# Altium project hand_logic.PrjPcb (part 1 of 3)
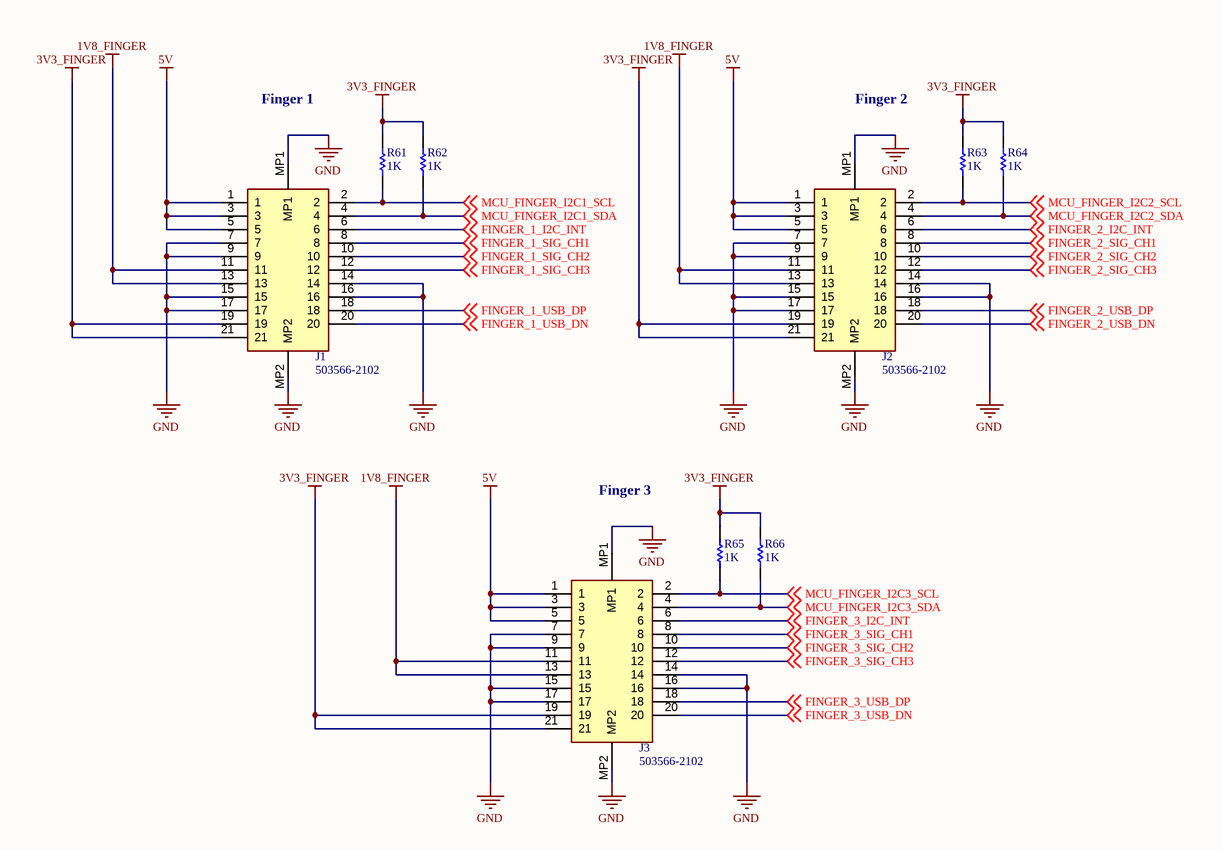
[diagram p0: FINGER_CONNECTORS.SchDoc]
15 sheets, 256 parts. Net scope: global (net labels, ports and power ports of the same name join across sheets).
Board file: hand_logic.PcbDoc
Sheets:
  FINGER_CONNECTORS.SchDoc
  PALM_CONNECTOR.SchDoc
  THUMB_CONNECTOR.SchDoc
  ISP_CONNECTORS.SchDoc
  ALLEGRO_CONNECTOR.SchDoc
  WALL_POWER.SchDoc
  HAND_CAN_MCU.SchDoc
  FINGER_MCU.SchDoc
  USB_CONNECTOR.SchDoc
  USB_HUB.SchDoc
  USB_HUB_SUPPORT.SchDoc
  USB_POWER.SchDoc
  USD_PD.SchDoc
  USB_PD_POWER.SchDoc
  FINGER_USB_HUB.SchDoc

## Sheet FINGER_CONNECTORS.SchDoc
size Letter; SheetNumber: 1; SheetTotal: 15

### Parts
J1  503566-2102  [5035662102]
J2  503566-2102  [5035662102]
J3  503566-2102  [5035662102]
R61  1K  [RESC1005X40X25LL05T10]
R62  1K  [RESC1005X40X25LL05T10]
R63  1K  [RESC1005X40X25LL05T10]
R64  1K  [RESC1005X40X25LL05T10]
R65  1K  [RESC1005X40X25LL05T10]
R66  1K  [RESC1005X40X25LL05T10]

### Nets
1V8_FINGER: J1.11 J1.13 J2.11 J2.13 J3.11 J3.13
3V3_FINGER: J1.19 J1.21 J2.19 J2.21 J3.19 J3.21 R61.2 R62.2 R63.2 R64.2 R65.2 R66.2
5V: J1.1 J1.3 J1.5 J2.1 J2.3 J2.5 J3.1 J3.3 J3.5
GND: J1.7 J1.9 J1.14 J1.15 J1.16 J1.17 J1.MP1 J1.MP2 J2.7 J2.9 J2.14 J2.15 J2.16 J2.17 J2.MP1 J2.MP2 J3.7 J3.9 J3.14 J3.15 J3.16 J3.17 J3.MP1 J3.MP2
FINGER_1_I2C_INT: J1.6 ; off-sheet FINGER_1_I2C_INT
FINGER_1_SIG_CH1: J1.8 ; off-sheet FINGER_1_SIG_CH1
FINGER_1_SIG_CH2: J1.10 ; off-sheet FINGER_1_SIG_CH2
FINGER_1_SIG_CH3: J1.12 ; off-sheet FINGER_1_SIG_CH3
FINGER_1_USB_DN: J1.20 ; off-sheet FINGER_1_USB_DN
FINGER_1_USB_DP: J1.18 ; off-sheet FINGER_1_USB_DP
FINGER_2_I2C_INT: J2.6 ; off-sheet FINGER_2_I2C_INT
FINGER_2_SIG_CH1: J2.8 ; off-sheet FINGER_2_SIG_CH1
FINGER_2_SIG_CH2: J2.10 ; off-sheet FINGER_2_SIG_CH2
FINGER_2_SIG_CH3: J2.12 ; off-sheet FINGER_2_SIG_CH3
FINGER_2_USB_DN: J2.20 ; off-sheet FINGER_2_USB_DN
FINGER_2_USB_DP: J2.18 ; off-sheet FINGER_2_USB_DP
FINGER_3_I2C_INT: J3.6 ; off-sheet FINGER_3_I2C_INT
FINGER_3_SIG_CH1: J3.8 ; off-sheet FINGER_3_SIG_CH1
FINGER_3_SIG_CH2: J3.10 ; off-sheet FINGER_3_SIG_CH2
FINGER_3_SIG_CH3: J3.12 ; off-sheet FINGER_3_SIG_CH3
FINGER_3_USB_DN: J3.20 ; off-sheet FINGER_3_USB_DN
FINGER_3_USB_DP: J3.18 ; off-sheet FINGER_3_USB_DP
MCU_FINGER_I2C1_SCL: J1.2 R61.1 ; off-sheet MCU_FINGER_I2C1_SCL
MCU_FINGER_I2C1_SDA: J1.4 R62.1 ; off-sheet MCU_FINGER_I2C1_SDA
MCU_FINGER_I2C2_SCL: J2.2 R63.1 ; off-sheet MCU_FINGER_I2C2_SCL
MCU_FINGER_I2C2_SDA: J2.4 R64.1 ; off-sheet MCU_FINGER_I2C2_SDA
MCU_FINGER_I2C3_SCL: J3.2 R65.1 ; off-sheet MCU_FINGER_I2C3_SCL
MCU_FINGER_I2C3_SDA: J3.4 R66.1 ; off-sheet MCU_FINGER_I2C3_SDA

### Notes on the sheet
- Finger 1
- Finger 2
- Finger 3
- Title
- Copyright (c) Meta Platforms, Inc. and affiliates.
  All rights reserved.
  This source code is licensed under the license found in the
  LICENSE file in the root directory of this source tree.
- Sheet
- of

### Library data of the parts
J1-J3 = 503566-2102: Connector; Manufacturer_Name: Molex; Datasheet Link: https://www.molex.com/pdm_docs/sd/5035662102_sd.pdf; Height: 1.69mm; Manufacturer_Part_Number: 503566-2102; Mouser Part Number: 538-503566-2102; Mouser Price/Stock: https://www.mouser.co.uk/ProductDetail/Molex/503566-2102?qs=0lSvoLzn4L8%252Bw2FHrppS3g%3D%3D
R61-R66 = CMP-2002-07941-1: Part Number: RC0402JR-071KL; Manufacturer: Yageo / Phycomp

## Sheet PALM_CONNECTOR.SchDoc
size Letter; SheetNumber: 2; SheetTotal: 15
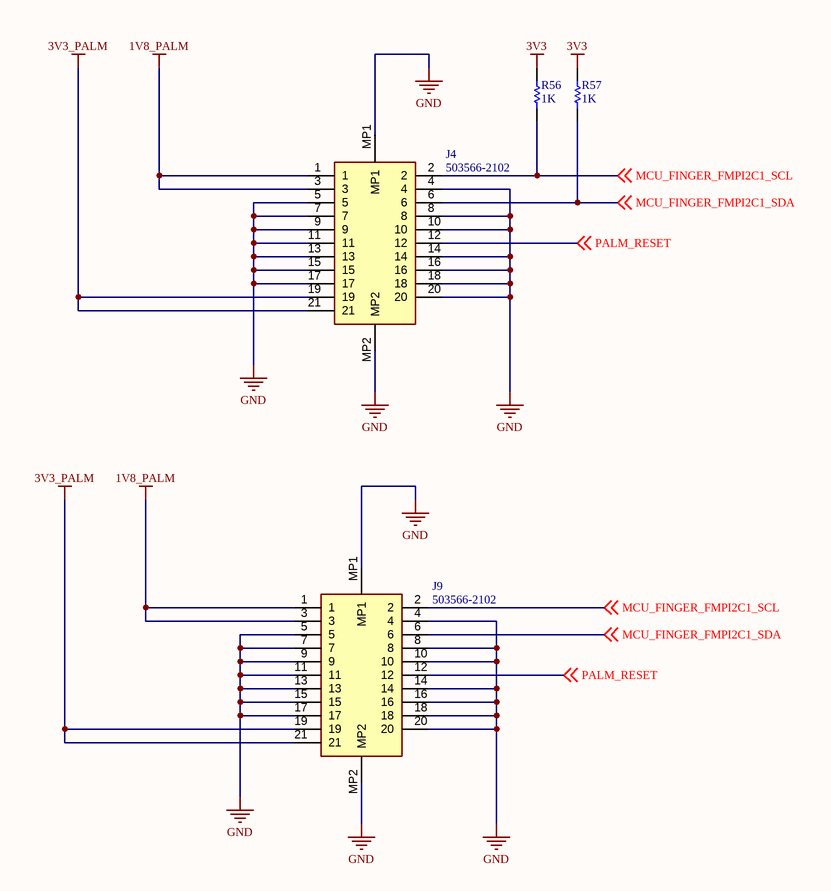
[diagram p1: PALM_CONNECTOR.SchDoc]

### Parts
J4  503566-2102  [5035662102]
J9  503566-2102  [5035662102]
R56  1K  [RESC1005X40X25LL05T10]
R57  1K  [RESC1005X40X25LL05T10]

### Nets
1V8_PALM: J4.1 J4.3 J9.1 J9.3
3V3: R56.2 R57.2
3V3_PALM: J4.19 J4.21 J9.19 J9.21
GND: J4.4 J4.5 J4.7 J4.8 J4.9 J4.10 J4.11 J4.13 J4.14 J4.15 J4.16 J4.17 J4.18 J4.20 J4.MP1 J4.MP2 J9.4 J9.5 J9.7 J9.8 J9.9 J9.10 J9.11 J9.13 J9.14 J9.15 J9.16 J9.17 J9.18 J9.20 J9.MP1 J9.MP2
MCU_FINGER_FMPI2C1_SCL: J4.2 J9.2 R56.1 ; off-sheet MCU_FINGER_FMPI2C1_SCL
MCU_FINGER_FMPI2C1_SDA: J4.6 J9.6 R57.1 ; off-sheet MCU_FINGER_FMPI2C1_SDA
PALM_RESET: J4.12 J9.12 ; off-sheet PALM_RESET

### Notes on the sheet
- Title
- Copyright (c) Meta Platforms, Inc. and affiliates.
  All rights reserved.
  This source code is licensed under the license found in the
  LICENSE file in the root directory of this source tree.
- Sheet
- of

### Library data of the parts
J4 J9 = 503566-2102: Connector; Manufacturer_Name: Molex; Datasheet Link: https://www.molex.com/pdm_docs/sd/5035662102_sd.pdf; Height: 1.69mm; Manufacturer_Part_Number: 503566-2102; Mouser Part Number: 538-503566-2102; Mouser Price/Stock: https://www.mouser.co.uk/ProductDetail/Molex/503566-2102?qs=0lSvoLzn4L8%252Bw2FHrppS3g%3D%3D
R56 R57 = CMP-2002-07941-1: as R61 on sheet FINGER_CONNECTORS

## Sheet THUMB_CONNECTOR.SchDoc
size Letter; SheetNumber: 3; SheetTotal: 15
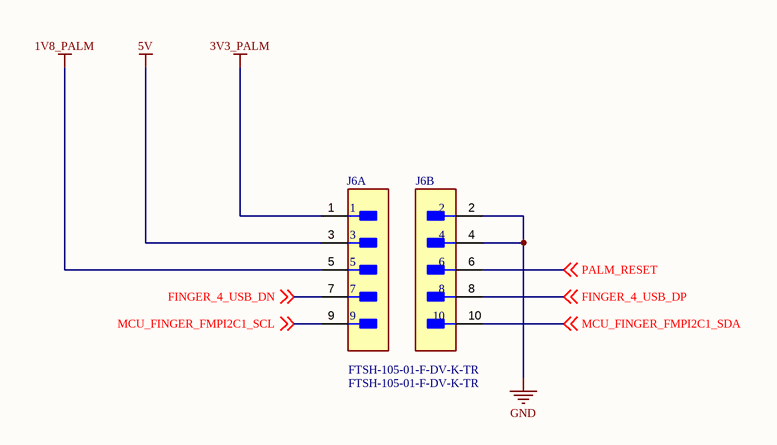
[diagram p2: THUMB_CONNECTOR.SchDoc]

### Parts
J6  FTSH-105-01-F-DV-K-TR  [FP-FTSH-105-01-F-DV-K-TR-MFG]  (parts A,B of 2)

### Nets
1V8_PALM: J6.5
3V3_PALM: J6.1
5V: J6.3
GND: J6.2 J6.4
FINGER_4_USB_DN: J6.7 ; off-sheet FINGER_4_USB_DN
FINGER_4_USB_DP: J6.8 ; off-sheet FINGER_4_USB_DP
MCU_FINGER_FMPI2C1_SCL: J6.9 ; off-sheet MCU_FINGER_FMPI2C1_SCL
MCU_FINGER_FMPI2C1_SDA: J6.10 ; off-sheet MCU_FINGER_FMPI2C1_SDA
PALM_RESET: J6.6 ; off-sheet PALM_RESET

### Notes on the sheet
- Title
- Copyright (c) Meta Platforms, Inc. and affiliates.
  All rights reserved.
  This source code is licensed under the license found in the
  LICENSE file in the root directory of this source tree.
- Sheet
- of

### Library data of the parts
J6 = CMP-02766-000004-2: CONN HEADER SMD 10POS 1.27MM; Number of Contacts: 10; Max Current Rating: 1.75A; Max Operating Temperature: 125°C; Number of Rows: 2; Pitch: 1.27mm; Contact Plating: Gold; Length: 6.35mm; Min Operating Temperature: -55°C; Packaging: Tape and Reel; Orientation: Straight; Contact Material: Bronze; Depth: 3.43mm; Housing Color: Black; Housing Material: Polymer; Radiation Hardening: No; Termination: Solder; Lead Free: Lead Free

## Sheet ISP_CONNECTORS.SchDoc
size Letter; SheetNumber: 4; SheetTotal: 15
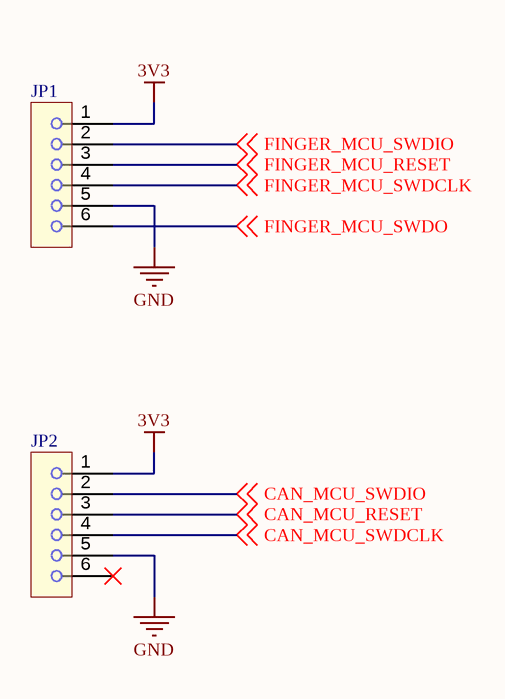
[diagram p3: ISP_CONNECTORS.SchDoc]

### Parts
JP1  TC2030-6-NL-FOOTPRINT  [TAG_TC2030_NL_6]  (value not drawn)  (no BOM)
JP2  TC2030-6-NL-FOOTPRINT  [TAG_TC2030_NL_6]  (value not drawn)  (no BOM)

### Nets
3V3: JP1.1 JP2.1
GND: JP1.5 JP2.5
CAN_MCU_RESET: JP2.3 ; off-sheet CAN_MCU_RESET
CAN_MCU_SWDCLK: JP2.4 ; off-sheet CAN_MCU_SWDCLK
CAN_MCU_SWDIO: JP2.2 ; off-sheet CAN_MCU_SWDIO
FINGER_MCU_RESET: JP1.3 ; off-sheet FINGER_MCU_RESET
FINGER_MCU_SWDCLK: JP1.4 ; off-sheet FINGER_MCU_SWDCLK
FINGER_MCU_SWDIO: JP1.2 ; off-sheet FINGER_MCU_SWDIO
FINGER_MCU_SWDO: JP1.6 ; off-sheet FINGER_MCU_SWDO

Not connected (* = marked no-connect by the designer): JP2 6*

### Notes on the sheet
- Title
- Copyright (c) Meta Platforms, Inc. and affiliates.
  All rights reserved.
  This source code is licensed under the license found in the
  LICENSE file in the root directory of this source tree.
- Sheet
- of

### Library data of the parts
JP1 JP2 = TC2030-6-NL-FOOTPRINT: CONN, FP, 2X3, .05, DEBUG, SMT; Manufacturer: NO PART; Part Number: FOOTPRINT ONLY

## Sheet ALLEGRO_CONNECTOR.SchDoc
size Letter; SheetNumber: 5; SheetTotal: 15; SPICEModelCacheFIYDHHWJ: <root> / <DocumentId>FIYDHHWJ</DocumentId> / <CacheFrame Number="0"> / <Model Name="umk325b7475_n-tr" Kind="CKT"> / <Text>* UMK325B7475_N-TR     SPICE MODEL  ( General Type ) / *-------------------------------------------------------------------------------------------------------- / * Model Generated by TAIYO YUDEN Corporation (http://www.ty-top.com) / * Version 1.0 / * TAIYO YUDEN Control No. 170508_110722 / * Copyright(c) 2012 TAIYO YUDEN CO.,LTD. All Rights Reserved. / *-------------------------------------------------------------------------------------------------------- / * / * Products Name : Multilayer Ceramic Capacitors / * / * Characteristics : / *     Capacitance : 4.7 uF , Rated Voltage : 50V , TCC : X7R / *     Case Size : 3.2 x 2.5 / 0.126 x 0.098 [mm/inch] , Thickness : 1.9 / 0.075 [mm/inch] / *     (Conditions: Temperature = 25 degC , DC Bias Current/Voltage = 0A / 0V) / * / * Frequency Range : 40Hz - 3GHz / * / * External Node Assignments : / * / *  1  o---| |---o  2 / * / *-------------------------------------------------------------------------------------------------------- / .SubCkt UMK325B7475_N-TR 1 2 / **************************** / C0 1 110 4.2842u / Cm 1 101 0.26769u / Rc1 101 102 1.3219 / C2 102 103 0.15728u / Rc2 102 103 266.31 / C3 103 110 22.789p / Rc3 103 110 35.595 / C2m 1 301 0.28635u / Rc21 301 302 14.59 / C22 302 303 1.5087u / Rc22 302 303 1.0546k / C23 303 304 0.049481u / Rc23 303 304 2.7033k / C24 304 305 0.062261u / Rc24 304 305 2.0733k / C25 305 110 58.302p / Rc25 305 110 991.63 / Rp0 1 110 106.382978723404Meg / L0 110 120 0.2425n / Lm 120 130 0.37058n / L1 120 121 0.44043n / RL1 121 130 0.21947 / L2 120 122 1.079n / RL2 122 130 0.54298 / L3 120 123 1.1393n / RL3 123 130 0.57182 / CR 120 124 0.72832u / LR 124 125 0.42802n / RR 125 130 36.415m / CL 130 140 14.134p / LL 130 140 0.20042n / RL 130 140 6.3872 / Rs 140 2 5.0797m / **************************** / .ends UMK325B7475_N-TR</Text> / </Model> / </CacheFrame> / </root>
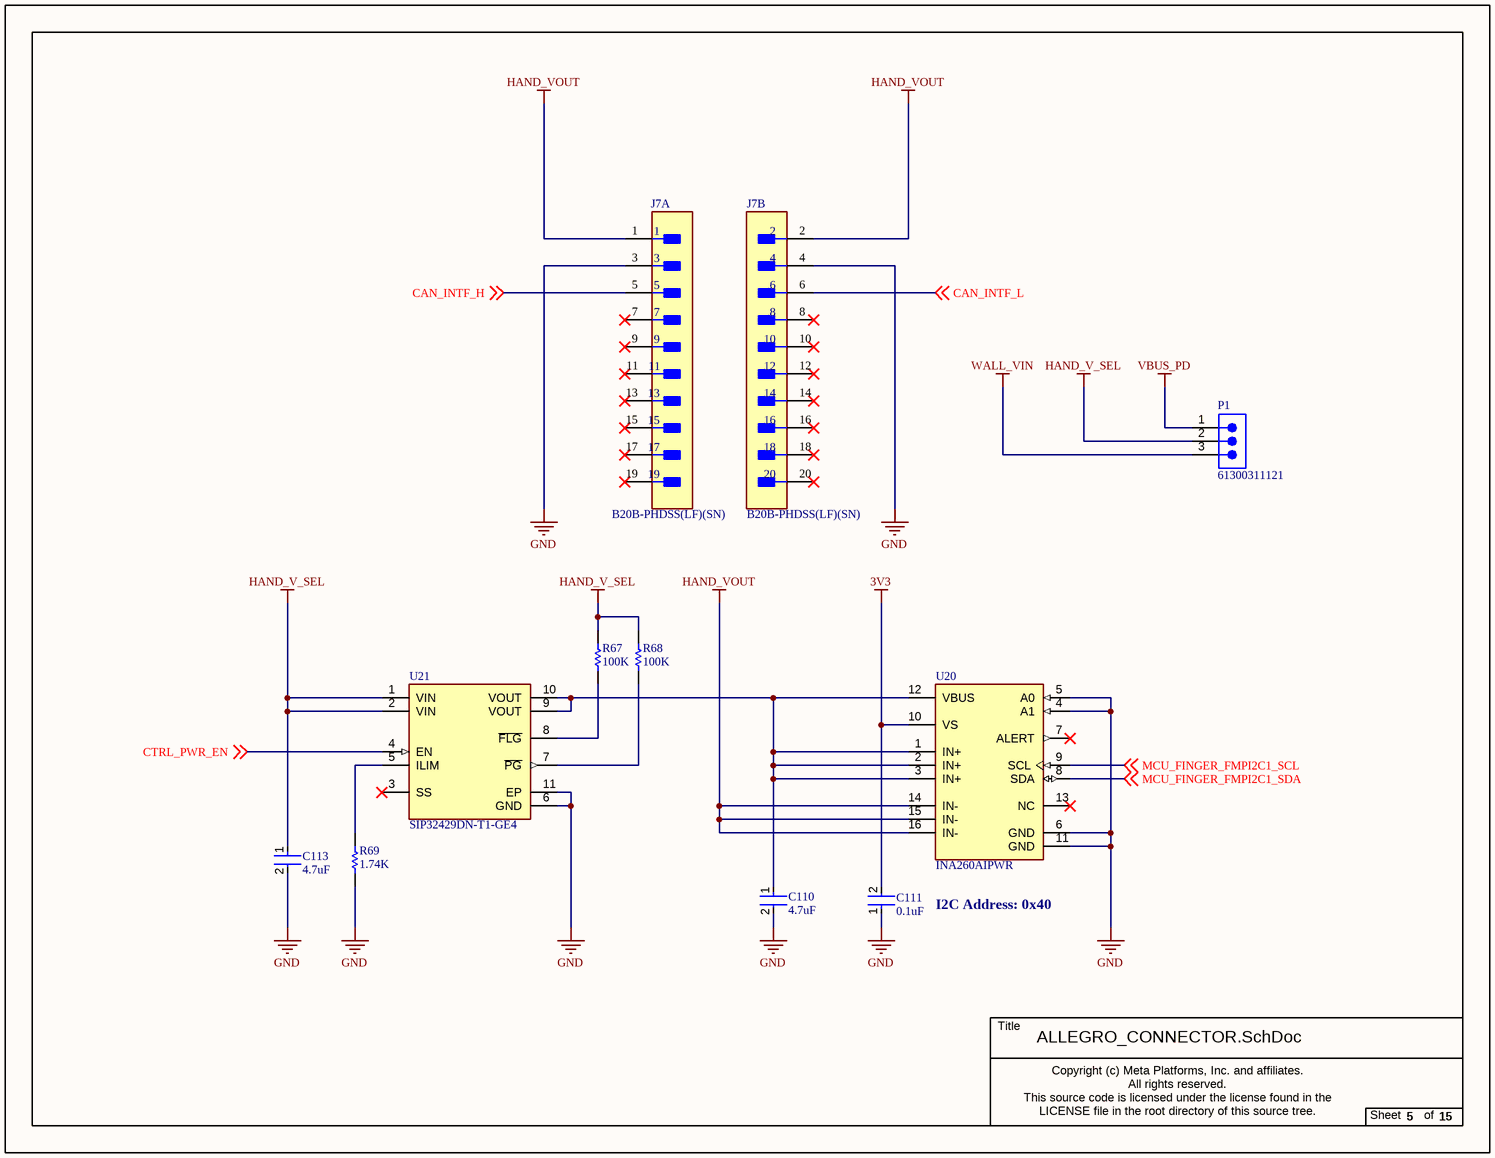
[diagram p4: ALLEGRO_CONNECTOR.SchDoc]

### Parts
C110  4.7uF  [FP-1210-L_3_2_0_3-W_2_5_0-IPC_B]
C111  0.1uF  [FP-CC0201-BA-MFG]
C113  4.7uF  [FP-1210-L_3_2_0_3-W_2_5_0-IPC_B]
J7  B20B-PHDSS(LF)(SN)  [FP-B20B-PHDSS_LF_SN-MFG]  (parts A,B of 2)
P1  61300311121  [61300311121]
R67  100K  [RESC1005X40X25NL05T10]
R68  100K  [RESC1005X40X25NL05T10]
R69  1.74K  [RESC1005X35X20ML05T10]
U20  INA260AIPWR  [FP-PW0016A-MFG]
U21  SIP32429DN-T1-GE4  [FP-S-42134-IPC_C]

### Nets
3V3: C111.2 U20.10(VS)
GND: C110.2 C111.1 C113.2 J7.3 J7.4 R69.1 U20.4(A1) U20.5(A0) U20.6(GND) U20.11(GND) U21.6(GND) U21.11(EP)
HAND_V_SEL: C113.1 P1.2 R67.2 R68.2 U21.1(VIN) U21.2(VIN)
HAND_VOUT: J7.1 J7.2 U20.14(IN-) U20.15(IN-) U20.16(IN-)
VBUS_PD: P1.1
WALL_VIN: P1.3
CAN_INTF_H: J7.5 ; off-sheet CAN_INTF_H
CAN_INTF_L: J7.6 ; off-sheet CAN_INTF_L
CTRL_PWR_EN: U21.4(EN) ; off-sheet CTRL_PWR_EN
MCU_FINGER_FMPI2C1_SCL: U20.9(SCL) ; off-sheet MCU_FINGER_FMPI2C1_SCL
MCU_FINGER_FMPI2C1_SDA: U20.8(SDA) ; off-sheet MCU_FINGER_FMPI2C1_SDA
NetC110_1: C110.1 U20.1(IN+) U20.2(IN+) U20.3(IN+) U20.12(VBUS) U21.9(VOUT) U21.10(VOUT)
NetR67_1: R67.1 U21.8(~{FLG})
NetR68_1: R68.1 U21.7(~{PG})
NetR69_2: R69.2 U21.5(ILIM)

Not connected (* = marked no-connect by the designer): J7 7* 8* 9* 10* 11* 12* 13* 14* 15* 16* 17* 18* 19* 20*; U20 7(ALERT)* 13(NC)*; U21 3(SS)*

### Notes on the sheet
- I2C Address: 0x40
- Title
- Copyright (c) Meta Platforms, Inc. and affiliates.
  All rights reserved.
  This source code is licensed under the license found in the
  LICENSE file in the root directory of this source tree.
- Sheet
- of

### Library data of the parts
C110 C113 = CMP-14477-001522-2: None; RoHS Compliant: Yes
C111 = CMP-03422-000376-1: CAP CER 0.1UF 6.3V X5R 0201; Manufacturer: Yageo; Manufacturer Part Number: CC0201KRX5R5BB104; Tolerance: 0.1; Temperature Coefficient: 15%; Value: 100 nF; Material: Ceramic; Automotive: No; Device Class L2: Capacitors; Temperature Range High: +85°C; Capacitance: 100 nF; Temperature: -55°C to +85°C; ComponentLink2URL: http://www.yageo.com/documents/recent/UPY-GPHC_X5R_4V-to-50V_25.pdf; Category: Cap; Mouser Description: Multilayer Ceramic Capacitors MLCC - SMD/SMT 100nF 6.3V X5R 10%; Ipc Land Pattern Name: CAPC6030X30; Temperature Characteristic: X5R; Voltage Rating: 6.3 V; Lead Free: Yes; Digikey Description: CAP CER 0.1UF 6.3V X5R 0201; Device Class L1: Passive Components; Octopart: https://octopart.com/cc0201krx5r5bb104-yageo-9292636; Height: 0.33mm; Package: CC0201-BA; Footprint Url: http://www.yageo.com/exep/pages/download/literatures/UPY-C_GEN_24.pdf; ComponentLink2Description: Datasheet; Device Class L3: Ceramic Capacitors; Temperature Range Low: -55°C; RoHS: TRUE
J7 = CMP-17439-000286-1: CONN HEADER VERT 20POS 2MM; Contact Resistance: 20mR; Current Rating: 3A; Number of Positions: 20; Gender: Male; Row Spacing: 0.079inch; Max Voltage Rating (DC): 250V; Mated Stacking Heights: 8.8mm; Contact Mating Length: 0.13inch; Lead Free: Lead Free; Pitch: 2mm; Fastening Type: Detent; Contact Shape: Square; Contact Type: Male Pin; Series: PHD; Max Current Rating: 3A; Housing Material: Polyamide; Width: 5mm; Depth: 5mm; Housing Color: Beige; Number of Contacts: 20; Flammability Rating: UL94 V-0; Insulation Color: Natural; Number of Rows: 2; Mount: Through Hole; Termination: Solder; Height: 9.5mm; Voltage Rating: 250V; Contact Finish - Mating: TIN; Color: Natural; Contact Plating: Copper; Min Operating Temperature: -25°C; Insulation Material: Nylon; Orientation: Straight; Max Operating Temperature: 85°C; Max Voltage Rating (AC): 250V; Length: 21.9mm; Packaging: Bulk; Connector Type: Header; Contact Material: Copper Alloy
P1 = CMP-1502-01062-2: NexarPartId: 32855521; Voltage Rating: 250V; Current Rating: 3A; Connector Type: Male Pin; Number of Positions: 3; Gender: Male; Contact Resistance: 20mΩ; Pitch: 2.54mm; Max Operating Temperature: 105°C; Lead Pitch: 2.54mm; Lead Free: Lead Free; Contact Mating Length: 5.9944mm; Contact Material: Copper; Number of Pins: 3; Orientation: Vertical; Height: 8.94mm; Packaging: Bulk; Min Operating Temperature: -40°C; Mount: Through Hole; RoHS: Compliant; Number of Contacts: 3; Operating Supply Voltage: 250V; Termination: Solder; Number of Rows: 1; Contact Plating: Gold; Color: Black; REACH SVHC: Unknown
R67 R68 = CMP-2002-07343-1: Part Number: RC0402FR-07100KL; Manufacturer: Yageo / Phycomp
R69 = CMP-2002-03190-1: Manufacturer: TE Connectivity / AMP; Part Number: CPF0402B1K74E1
U20 = CMP-04910-000015-1: IC MONITOR PWR/CURR 16TSSOP; Manufacturer: Texas Instruments; Nominal Supply Current: 310uA; Max Junction Temp: +150°C; Standoff Height: 0.05mm; Max Supply Voltage: 5.5V; Min Supply Voltage: 2.7V; Output Current: 10mA; Ambient Temperature Range High: +125°C; ComponentLink2Description: Datasheet; Manufacturer Part Number: INA260AIPWR; Automotive: No; RoHS: TRUE; Lead Free: Yes; Package: PW0016A; Device Class L2: Power Management ICs; Temperature Range Low: -40°C; Digikey Description: IC MONITOR PWR/CURR 16TSSOP; Height: 1.2mm; Temperature: -40°C to +125°C; Device Class L1: Integrated Circuits (ICs); Device Class L3: unset; Octopart: https://octopart.com/ina260aipwr-texas+instruments-75199489; Category: IC; Ambient Temperature Range Low: -40°C; Temperature Range High: +125°C; ComponentLink2URL: http://www.ti.com/lit/ds/symlink/ina260.pdf
U21 = CMP-02501-000003-1: IC PWR SWITCH P-CHAN 1:1 10DFN; Turn-Off Delay Time: 1us; Output Configuration: High Side; Number of Outputs: 1; Fault Protection: Over Temperature; Max Supply Voltage: 28V; On-State Resistance: 56mR; Min Supply Voltage: 6V; Max Output Current: 3.5A; Turn-On Delay Time: 550us; Max Power Dissipation: 1.42W; Interface: On/Off; Max Operating Temperature: 85°C; Radiation Hardening: No; Min Operating Temperature: -40°C; Number of Pins: 10; Package Quantity: 2500; Case/Package: DFN; Weight: 0.001764oz; Packaging: Tape and Reel; Mount: Surface Mount

## Sheet WALL_POWER.SchDoc
size Letter; SheetNumber: 6; SheetTotal: 15; SPICEModelCacheTADBTSLA: <root> / <DocumentId>TADBTSLA</DocumentId> / </root>
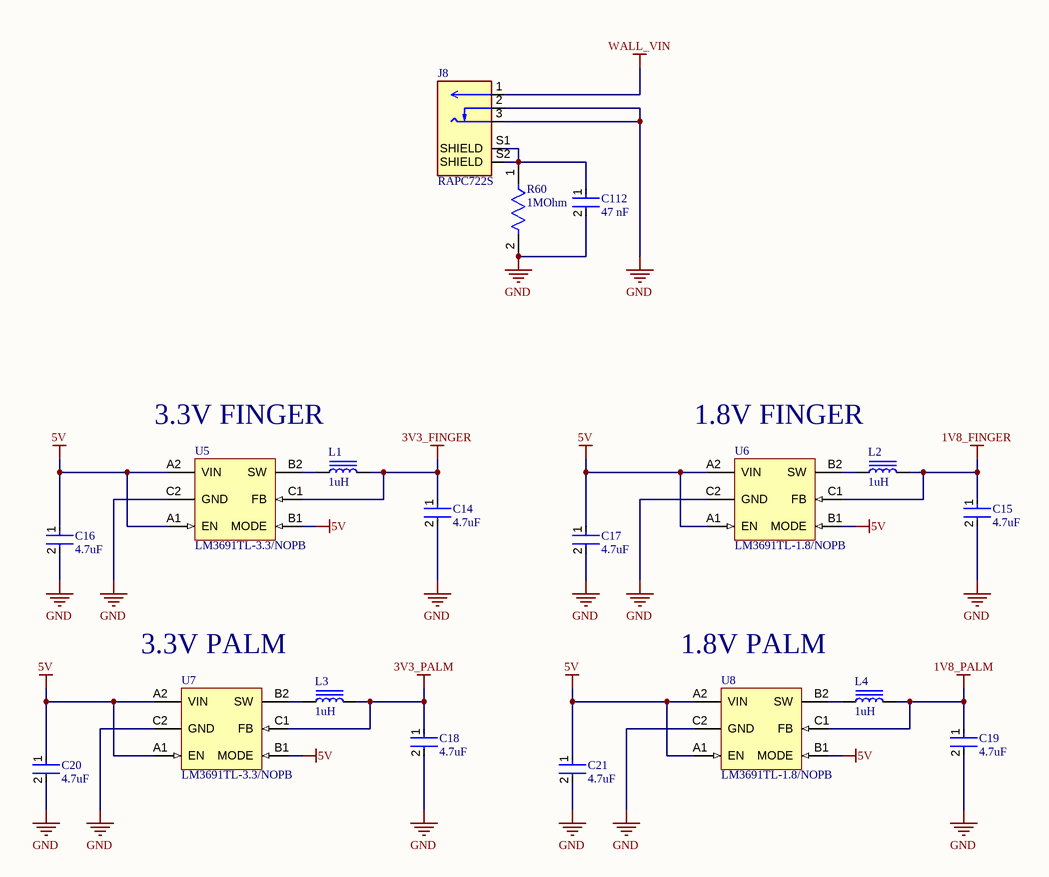
[diagram p5: WALL_POWER.SchDoc]

### Parts
C14  4.7uF  [FP-CL828-IPC_C]
C15  4.7uF  [FP-CL828-IPC_C]
C16  4.7uF  [FP-CL828-IPC_C]
C17  4.7uF  [FP-CL828-IPC_C]
C18  4.7uF  [FP-CL828-IPC_C]
C19  4.7uF  [FP-CL828-IPC_C]
C20  4.7uF  [FP-CL828-IPC_C]
C21  4.7uF  [FP-CL828-IPC_C]
C112  47 nF  [FP-CC0402-MFG]
J8  RAPC722S  [SWITCHCRAFT_RAPC722S]
L1  1uH  [IND 0603_1608 RF WW]
L2  1uH  [IND 0603_1608 RF WW]
L3  1uH  [IND 0603_1608 RF WW]
L4  1uH  [IND 0603_1608 RF WW]
R60  1MOhm  [FP-RMCF0402-MFG]
U5  LM3691TL-3.3/NOPB  [YZR0006APAF]
U6  LM3691TL-1.8/NOPB  [YZR0006APAF]
U7  LM3691TL-3.3/NOPB  [YZR0006APAF]
U8  LM3691TL-1.8/NOPB  [YZR0006APAF]

### Nets
1V8_FINGER: C15.1 L2.2 U6.C1(FB)
1V8_PALM: C19.1 L4.2 U8.C1(FB)
3V3_FINGER: C14.1 L1.2 U5.C1(FB)
3V3_PALM: C18.1 L3.2 U7.C1(FB)
5V: C16.1 C17.1 C20.1 C21.1 U5.A1(EN) U5.A2(VIN) U5.B1(MODE) U6.A1(EN) U6.A2(VIN) U6.B1(MODE) U7.A1(EN) U7.A2(VIN) U7.B1(MODE) U8.A1(EN) U8.A2(VIN) U8.B1(MODE)
GND: C14.2 C15.2 C16.2 C17.2 C18.2 C19.2 C20.2 C21.2 C112.2 J8.2(SHUNT) J8.3(TIP) R60.2 U5.C2(GND) U6.C2(GND) U7.C2(GND) U8.C2(GND)
WALL_VIN: J8.1(PIN)
NetC112_1: C112.1 J8.S1(SHIELD) J8.S2(SHIELD) R60.1
NetL1_1: L1.1 U5.B2(SW)
NetL2_1: L2.1 U6.B2(SW)
NetL3_1: L3.1 U7.B2(SW)
NetL4_1: L4.1 U8.B2(SW)

### Notes on the sheet
- 3.3V FINGER
- 1.8V FINGER
- 3.3V PALM
- 1.8V PALM
- Title
- Copyright (c) Meta Platforms, Inc. and affiliates.
  All rights reserved.
  This source code is licensed under the license found in the
  LICENSE file in the root directory of this source tree.
- Sheet
- of

### Library data of the parts
C14-C21 = CMP-13271-001251-1: Cap Ceramic 4.7uF 10V X5R ±10% SMD 0402 +85°C Paper T/R; Height: 0.5mm; Mount: Surface Mount; Case Code (Metric): 1005; Case/Package: 0402; Capacitance: 4.7uF; Packaging: Tape and Reel; Dielectric: X5R; Radiation Hardening: No; Material: Ceramic; Thickness: 0.022inch; Min Operating Temperature: -55°C; Voltage Rating: 10V; Case Code (Imperial): 0402; Width: 0.02inch; Length: 1mm; Max Operating Temperature: 85°C; Lead Free: Lead Free; Tolerance: 10%; Package Quantity: 1; Depth: 0.5mm
C112 = CMP-03422-000813-1: CAP CER 0.047UF 25V X7R 0402; Manufacturer Part Number: CC0402KRX7R8BB473; Manufacturer: YAGEO; Automotive Grade: NA; Temperature Coefficient: 30ppm/°C; Material: Ceramic; Tolerance: 0.1; Temperature: -55°C to +125°C; Category: Cap; Voltage Rating: 25 V; Digikey Description: CAP CER 0.047UF 25V X7R 0402; Device Class L1: Passive Components; Device Class L3: Ceramic Capacitors; Ipc Land Pattern Name: CAPC10050X50; Value: 47 nF; Temperature Characteristic: X7R; Temperature Range High: +125°C; ComponentLink2URL: http://www.yageo.com/documents/recent/UPY-GP_NP0_16V-to-50V_16.pdf; Automotive: No; Temperature Range Low: -55°C; Package: CC0402; RoHS: TRUE; Height: 0.55mm; Device Class L2: Capacitors; Capacitance: 47 nF; Octopart: https://octopart.com/cc0402krx7r8bb473-yageo-22850998; Lead Free: Yes; Mouser Description: Multilayer Ceramic Capacitors MLCC - SMD/SMT 47nF 25V X7R 10%; Footprint Url: http://www.yageo.com/exep/pages/download/literatures/UPY-C_GEN_24.pdf; ComponentLink2Description: Datasheet
J8 = RAPC722S: Power Barrel Connector Jack 2.10mm ID (0.083), 5.50mm OD (0.217) Through Hole, Right Angle; MF: Switchcraft Inc.; Package: None; Digi-Key_Part_Number: SC3723-ND; Purchase-URL: https://pricing.snapeda.com/search/part/RAPC722S/?ref=eda; Value: *; SnapEDA_Link: https://www.snapeda.com/parts/RAPC722S/Switchcraft+%252F+Conxall/view-part/?ref=snap; Check_prices: https://www.snapeda.com/parts/RAPC722S/Switchcraft+%252F+Conxall/view-part/?ref=eda; MP: RAPC722S
L1-L4 = MCHK1608T1R0MKN: SMT Inductor; Manufacturer: Taiyo Yuden; Part Number: MCHK1608T1R0MKN; Value: 1uH
R60 = CMP-2000-06985-2: 1MΩ ±1% 0.063W 0402 Thick Film Chip Resistor AEC-Q200 compliant; Max Power Dissipation: 63mW; Resistance: 1MR; Power Rating: 62.5mW; Temperature Coefficient: 100ppm/°C; Resistor Type: Thick Film; Military Standard: Not; Packaging: Tape and Reel; Radiation Hardening: No; Construction: Rectangular; Length: 1mm; Case/Package: 0402; Width: 0.02inch; Case Code (Imperial): 0402; Lead Free: Lead Free; Number of Terminations: 2; Min Operating Temperature: -55°C; Height: 0.016inch; Tolerance: 1%; Contact Plating: Tin; Case Code (Metric): 1005; Depth: 0.5mm; Features: Automotive AEC-Q200; Max Operating Temperature: 155°C; Size Code: 0402; Mount: Surface Mount; RoHS Compliant: Yes; Series: RMCF
U5 U7 = CMP-0063-01484-2: High Accuracy, Miniature 1A, Step-Down DC-DC Converter for Portable Applications, 6-pin Micro SMD, 250 Reel; Manufacturer: Texas Instruments; PackageTopMarking: XV*I T; PowerWise: N; CompType: MiscPower; High-Reliability: Y; RoHS: Y; PackageDescription: Thin Micro SMD, 6 Bump (Large), 0.5mm Pitch; PinCount: 6; ComponentLink1URL: http://www.ti.com/general/docs/lit/getliterature.tsp?genericPartNumber=LM3691&fileType=pdf; PackageReference: YZR0006APAF; PartNumber: LM3691TL-3.3/NOPB; ComponentLink1Description: Datasheet URL; Code_JEDEC: MO-211-DB
U6 U8 = CMP-0063-00271-3: High Accuracy, Miniature 1A, Step-Down DC-DC Converter for Portable Applications, 6-pin Micro SMD, Pb-Free; Manufacturer: Texas Instruments; PackageTopMarking: XV*I Z; CompType: MiscPower; High-Reliability: Y; PinCount: 6; PartNumber: LM3691TL-1.8/NOPB; PackageDescription: Thin Micro SMD, 6 Bump (Large), 0.5mm Pitch; RoHS: Y; PackageReference: YZR0006APAF; ComponentLink1URL: http://www.ti.com/general/docs/lit/getliterature.tsp?genericPartNumber=LM3691&fileType=pdf; Code_JEDEC: MO-211-DB; ComponentLink1Description: Datasheet URL; PowerWise: Y

## Sheet HAND_CAN_MCU.SchDoc
size Letter; SheetNumber: 7; SheetTotal: 15
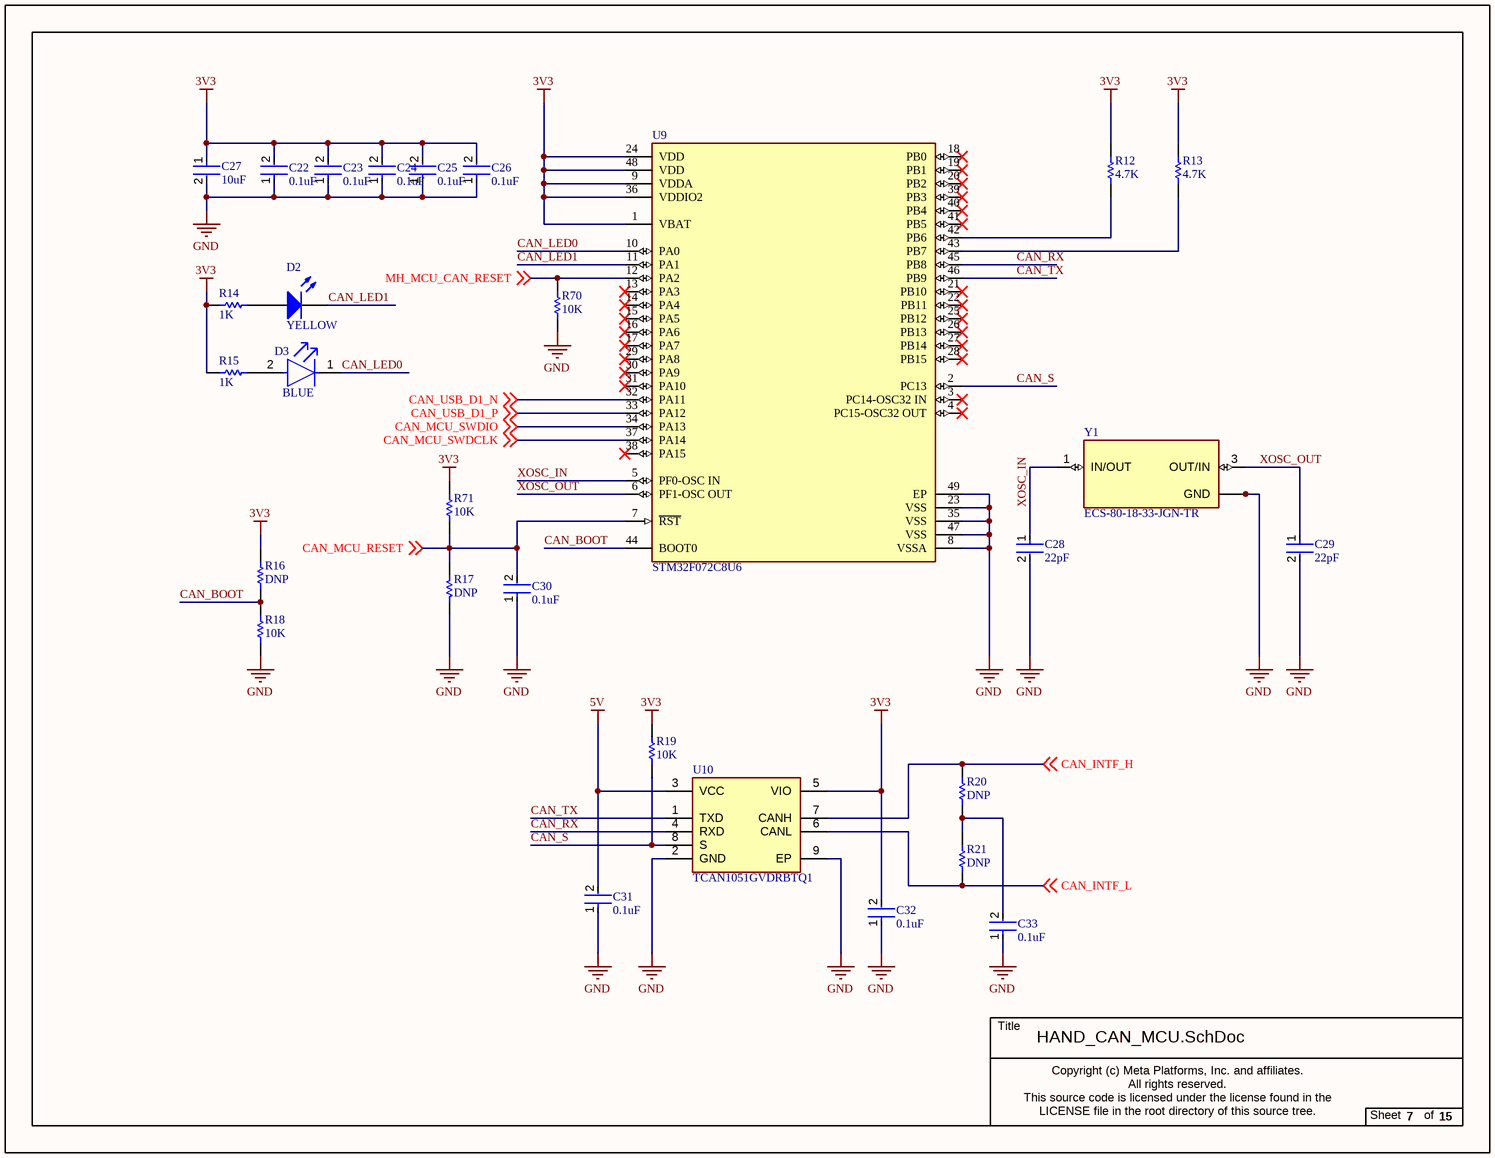
[diagram p6: HAND_CAN_MCU.SchDoc]

### Parts
C22  0.1uF  [FP-CC0201-BA-MFG]
C23  0.1uF  [FP-CC0201-BA-MFG]
C24  0.1uF  [FP-CC0201-BA-MFG]
C25  0.1uF  [FP-CC0201-BA-MFG]
C26  0.1uF  [FP-CC0201-BA-MFG]
C27  10uF  [FP-CL05A106MP5NUNC-MFG]
C28  22pF  [FP-0402-L_1_0_1-W_0_5_0_1-MFG]
C29  22pF  [FP-0402-L_1_0_1-W_0_5_0_1-MFG]
C30  0.1uF  [FP-CC0201-BA-MFG]
C31  0.1uF  [FP-CC0201-BA-MFG]
C32  0.1uF  [FP-CC0201-BA-MFG]
C33  0.1uF  [FP-CC0201-BA-MFG]
D2  YELLOW  [0603_A]
D3  BLUE  [FP-LTST-C191TBKT-MFG]
R12  4.7K  [RESC1005X40X25LL05T05]
R13  4.7K  [RESC1005X40X25LL05T05]
R14  1K  [RESC1005X40X25NL05T05]
R15  1K  [RESC1005X40X25NL05T05]
R16  DNP  [RESC1005X40X25ML05T10]
R17  DNP  [RESC1005X40X25NL05T10]
R18  10K  [RESC1005X40X25ML05T10]
R19  10K  [RESC1005X40X25ML05T10]
R20  DNP  [RESC1005X40X25ML05T10]
R21  DNP  [RESC1005X40X25ML05T10]
R70  10K  [RESC1005X40X25ML05T10]
R71  10K  [RESC1005X40X25ML05T10]
U9  STM32F072C8U6  [FP-UFQFPN48-A0B9-MFG]
U10  TCAN1051GVDRBTQ1  [SON65P300X300X100-9N-D]
Y1  ECS-80-18-33-JGN-TR  [XTAL_ECS-240-8-33-AGN-TR]

### Nets
3V3: C22.2 C23.2 C24.2 C25.2 C26.2 C27.1 C32.2 R12.2 R13.2 R14.1 R15.1 R16.2 R19.2 R71.2 U9.1(VBAT) U9.9(VDDA) U9.24(VDD) U9.36(VDDIO2) U9.48(VDD) U10.5(VIO)
5V: C31.2 U10.3(VCC)
GND: C22.1 C23.1 C24.1 C25.1 C26.1 C27.2 C28.2 C29.2 C30.1 C31.1 C32.1 C33.1 R17.1 R18.1 R70.1 U9.8(VSSA) U9.23(VSS) U9.35(VSS) U9.47(VSS) U9.49(EP) U10.2(GND) U10.9(EP) Y1.2(GND) Y1.4(GND)
CAN_BOOT: R16.1 R18.2 U9.44(BOOT0)
CAN_INTF_H: R20.2 U10.7(CANH) ; off-sheet CAN_INTF_H
CAN_INTF_L: R21.1 U10.6(CANL) ; off-sheet CAN_INTF_L
CAN_LED0: D3.1(C) U9.10(PA0)
CAN_LED1: D2.1(K) U9.11(PA1)
CAN_MCU_RESET: C30.2 R17.2 R71.1 U9.7(~{RST}) ; off-sheet CAN_MCU_RESET
CAN_MCU_SWDCLK: U9.37(PA14) ; off-sheet CAN_MCU_SWDCLK
CAN_MCU_SWDIO: U9.34(PA13) ; off-sheet CAN_MCU_SWDIO
CAN_RX: U9.45(PB8) U10.4(RXD)
CAN_S: R19.1 U9.2(PC13) U10.8(S)
CAN_TX: U9.46(PB9) U10.1(TXD)
CAN_USB_D1_N: U9.32(PA11) ; off-sheet CAN_USB_D1_N
CAN_USB_D1_P: U9.33(PA12) ; off-sheet CAN_USB_D1_P
MH_MCU_CAN_RESET: R70.2 U9.12(PA2) ; off-sheet MH_MCU_CAN_RESET
XOSC_IN: C28.1 U9.5(PF0-OSC_IN) Y1.1(IN/OUT)
XOSC_OUT: C29.1 U9.6(PF1-OSC_OUT) Y1.3(OUT/IN)
NetC33_2: C33.2 R20.1 R21.2
NetD2_2: D2.2(A) R14.2
NetD3_2: D3.2(A) R15.2
NetR12_1: R12.1 U9.42(PB6)
NetR13_1: R13.1 U9.43(PB7)

Not connected (* = marked no-connect by the designer): U9 3(PC14-OSC32_IN)* 4(PC15-OSC32_OUT)* 13(PA3)* 14(PA4)* 15(PA5)* 16(PA6)* 17(PA7)* 18(PB0)* 19(PB1)* 20(PB2)* 21(PB10)* 22(PB11)* 25(PB12)* 26(PB13)* 27(PB14)* 28(PB15)* 29(PA8)* 30(PA9)* 31(PA10)* 38(PA15)* 39(PB3)* 40(PB4)* 41(PB5)*

### Notes on the sheet
- Title
- Copyright (c) Meta Platforms, Inc. and affiliates.
  All rights reserved.
  This source code is licensed under the license found in the
  LICENSE file in the root directory of this source tree.
- Sheet
- of

### Library data of the parts
C22-C26 C30-C33 = CMP-03422-000376-1: as C111 on sheet ALLEGRO_CONNECTOR; Automotive: No; Device Class L2: Capacitors; Temperature Range High: +85°C; Capacitance: 100 nF; Temperature: -55°C to +85°C; ComponentLink2URL: http://www.yageo.com/documents/recent/UPY-GPHC_X5R_4V-to-50V_25.pdf; Category: Cap; Mouser Description: Multilayer Ceramic Capacitors MLCC - SMD/SMT 100nF 6.3V X5R 10%; Ipc Land Pattern Name: CAPC6030X30; Temperature Characteristic: X5R; Voltage Rating: 6.3 V; Lead Free: Yes; Digikey Description: CAP CER 0.1UF 6.3V X5R 0201; Device Class L1: Passive Components; Octopart: https://octopart.com/cc0201krx5r5bb104-yageo-9292636; Height: 0.33mm; Package: CC0201-BA; Footprint Url: http://www.yageo.com/exep/pages/download/literatures/UPY-C_GEN_24.pdf; ComponentLink2Description: Datasheet; Device Class L3: Ceramic Capacitors; Temperature Range Low: -55°C; RoHS: TRUE
C27 = CMP-13271-000002-1: CAP CER 10UF 10V X5R 0402; Manufacturer Part Number: CL05A106MP5NUNC; Manufacturer: Samsung; Temperature Coefficient: 15%; Tolerance: 20%; Material: Ceramic; Octopart: https://octopart.com/cl05a106mp5nunc-samsung-22457395; Voltage Rating: 10V; RoHS: TRUE; Value: 10uF; Height: 0.7mm; Digikey Description: CAP CER 10UF 10V X5R 0402; Automotive: No; Package: CL05A106MP5NUNC; Device Class L1: Passive Components; Capacitance: 10uF; Temperature Range High: +85°C; ComponentLink2Description: Datasheet; Device Class L2: Capacitors; Temperature Characteristic: X5R; Temperature: -55°C to +85°C; ComponentLink2URL: http://www.samsungsem.com/kr/support/product-search/mlcc/__icsFiles/afieldfile/2019/05/10/19-CL05A106MP5NUNC.pdf; Device Class L3: Ceramic Capacitors; Category: Cap; Temperature Range Low: -55°C; Ipc Land Pattern Name: CAPC10050X50; Lead Free: Yes
C28 C29 = CMP-2008-02613-2: General Purpose Ceramic Capacitor, 0402, 22pF, 5%, C0G, 30ppm/°C, 50V; Temperature Coefficient: 30ppm/°C; Mount: Surface Mount; Length: 1mm; Construction: Flat; Contact Plating: Tin; REACH SVHC: No SVHC; Case/Package: 0402; Voltage: 50V; Case Code (Imperial): 0402; Thickness: 0.022inch; Radiation Hardening: No; Number of Pins: 2; Tolerance: 5%; Max Operating Temperature: 125°C; RoHS Compliant: Yes; Voltage Rating: 50V; Case Code (Metric): 1005; Package Quantity: 1; Width: 0.02inch; Termination: SMD/SMT; Lead Free: Lead Free; Height: 0.5mm; Voltage Rating (DC): 50V; Capacitance: 22pF; Min Operating Temperature: -55°C; Series: -; Depth: 0.5mm; Dielectric: C0G; Packaging: Tape and Reel
D2 = CMP-1426-00005-1: SMD mono-color Chip LED, WL-SMCW, Yellow; PartNumber: 150060YS75000; Manufacturer: Wuerth Elektronik; ComponentLink1URL: http://www.we-online.com; Color: Yellow; ComponentLink2Description: Datasheet; ComponentLink2URL: http://katalog.we-online.com/led/datasheet/150060YS75000.pdf; ComponentLink1Description: Manufacturer URL; PackageReference: 0603_A
D3 = CMP-22017-000008-1: LED BLUE CLEAR CHIP SMD; Lens Color: Colorless; Dominant Wavelength: 475nm; Forward Current: 20mA; Wavelength: 468nm; Viewing Angle: 130°; Power Dissipation: 76mW; Luminous Intensity: 180mcd; Reverse Voltage: 5V; Number of Elements: 1; Lens Style: Diffused; Forward Voltage: 3.8V; Max Power Dissipation: 75mW; Case Code (Metric): 1608; Packaging: Tape and Reel; Case/Package: 0603; Depth: 1.6mm; Mount: Surface Mount; Lead Free: Lead Free; Min Operating Temperature: -20°C; Lens Transparency: Clear; Illumination Color: Blue; Height: 0.55mm; Test Current: 20mA; Case Code (Imperial): 0603; Max Operating Temperature: 80°C; Number of Pins: 2; Length: 0.8mm; Radiation Hardening: No; Package Quantity: 1; Number of LEDs: 1; Width: 0.8mm; Color: Blue
R12 R13 = CMP-2002-01154-4: Chip Resistor, 4.7 KOhm, +/- 1%, 0.1 W, -55 to 155 degC, 0402 (1005 Metric), RoHS, Tape and Reel; PartNumber: ERJ-2RKF4701X; Voltage Rating: 50 V; Case\/Package: 0402; Power Rating: 100 mW; Height: 0.35 mm; Mounting Technology: Surface Mount; REACH SVHC: Yes; Resistance: 4.7 KOhm; Max Operating Temperature: 155 degC; ComponentLink1Description: Manufacturer URL; ComponentLink2Description: Datasheet; Pins: 2; PackageReference: 0402; Tolerance: 1%; Case Code (Imperial): 0402; Length: 1 mm; PackageDescription: 2-Pin Surface Mount Device, Body 1 x 0.5 mm; RoHSCompliant: true; Package Quantity: 1; Radiation Hardening: No; DatasheetVersion: 04/2015; Width: 0.5 mm; Case Code (Metric): 1005; Mount: Surface Mount; ComponentLink1URL: http://www.panasonic.com/; Min Operating Temperature: -55 degC; Packaging: Cut Tape; ComponentLink2URL: http://industrial.panasonic.com/cdbs/www-data/pdf/RDA0000/AOA0000C86.pdf
R14 R15 = CMP-1011-00510-4: Chip Resistor, 1 KOhm, +/- 1%, 100 mW, -55 to 155 degC, 0402 (1005 Metric), RoHS, Tape and Reel; PartNumber: ERJ-2RKF1001X; Manufacturer: Basic Passives; Voltage Rating: 50 V; Case\/Package: 0402; Resistance: 1 KOhm; Power Rating: 100 mW; DatasheetVersion: 04/2015; Radiation Hardening: No; Pins: 2; Height: 0.35 mm; RoHSCompliant: true; Case Code (Imperial): 0402; ComponentLink2Description: Datasheet; ComponentLink1Description: Manufacturer URL; PackageReference: 0402; Mount: Surface Mount; Package Quantity: 10000; Tolerance: 1%; ComponentLink1URL: http://www.panasonic.com/; PackageDescription: 2-Pin Surface Mount Device, Body 1 x 0.5 mm; Mounting Technology: Surface Mount; Case Code (Metric): 1005; ComponentLink2URL: http://industrial.panasonic.com/cdbs/www-data/pdf/RDA0000/AOA0000C86.pdf; REACH SVHC: Yes; Packaging: Tape and Reel; Max Operating Temperature: 155 degC; Min Operating Temperature: -55 degC; Width: 0.5 mm; Length: 1 mm
R16 R18-R21 R70 R71 = CMP-2002-03043-1: Part Number: CRCW040210K0FKEDHP; Manufacturer: Vishay Dale
R17 = CMP-1011-00001-2: Manufacturer: Yageo / Phycomp; Part Number: RC0402JR-070RL
U9 = CMP-0304-00167-3: IC MCU 32BIT 64KB FLASH 48UFQFPN; Max Supply Voltage: 3.6V; RAM Size: 16KB; Oscillator Type: Internal; Watchdog Timer: Yes; Max Power Dissipation: 625mW; Number of I/Os: 37; Data Bus Width: 32b; Peripherals: POR; Number of ADC Channels: 13; Interface: I2C; Number of Timers/Counters: 9; Core Architecture: ARM; Min Supply Voltage: 2V; Frequency: 48MHz; RoHS Compliant: Yes; Case/Package: UFQFPN; Min Operating Temperature: -40°C; Memory Size: 64KB; Memory Type: FLASH; Number of Pins: 48; Max Operating Temperature: 85°C; Packaging: Tray; Number of Programmable I/O: 37; Package Quantity: 1560; Lead Free: Lead Free; Max Frequency: 48MHz
U10 = TCAN1051GVDRBTQ1: Integrated Circuit; Manufacturer_Name: Texas Instruments; Datasheet Link: http://www.ti.com/lit/gpn/tcan1051gv-q1; Height: 1mm; Manufacturer_Part_Number: TCAN1051GVDRBTQ1; Mouser Part Number: 595-TCAN1051GVDRBTQ1; Mouser Price/Stock: https://www.mouser.co.uk/ProductDetail/Texas-Instruments/TCAN1051GVDRBTQ1?qs=HXFqYaX1Q2wS4ATjga%252BGjQ%3D%3D; Arrow Part Number: TCAN1051GVDRBTQ1; Arrow Price/Stock: https://www.arrow.com/en/products/tcan1051gvdrbtq1/texas-instruments?region=nac
Y1 = ECS-80-18-33-JGN-TR: The sub miniature ECX-32 is a compact SMD Crystal. The 3.2 x 2.5 x 0.8 mm ceramic package is ideal for todayâ€™s SMD manufacturing environment.; MF: {'manufacturer': u'ECS Inc.'}; Price: None; Value: *; Package: None; Availability: Unavailable; MP: ECS-80-18-33-JGN-TR

## Sheet FINGER_MCU.SchDoc
size Letter; SheetNumber: 8; SheetTotal: 15
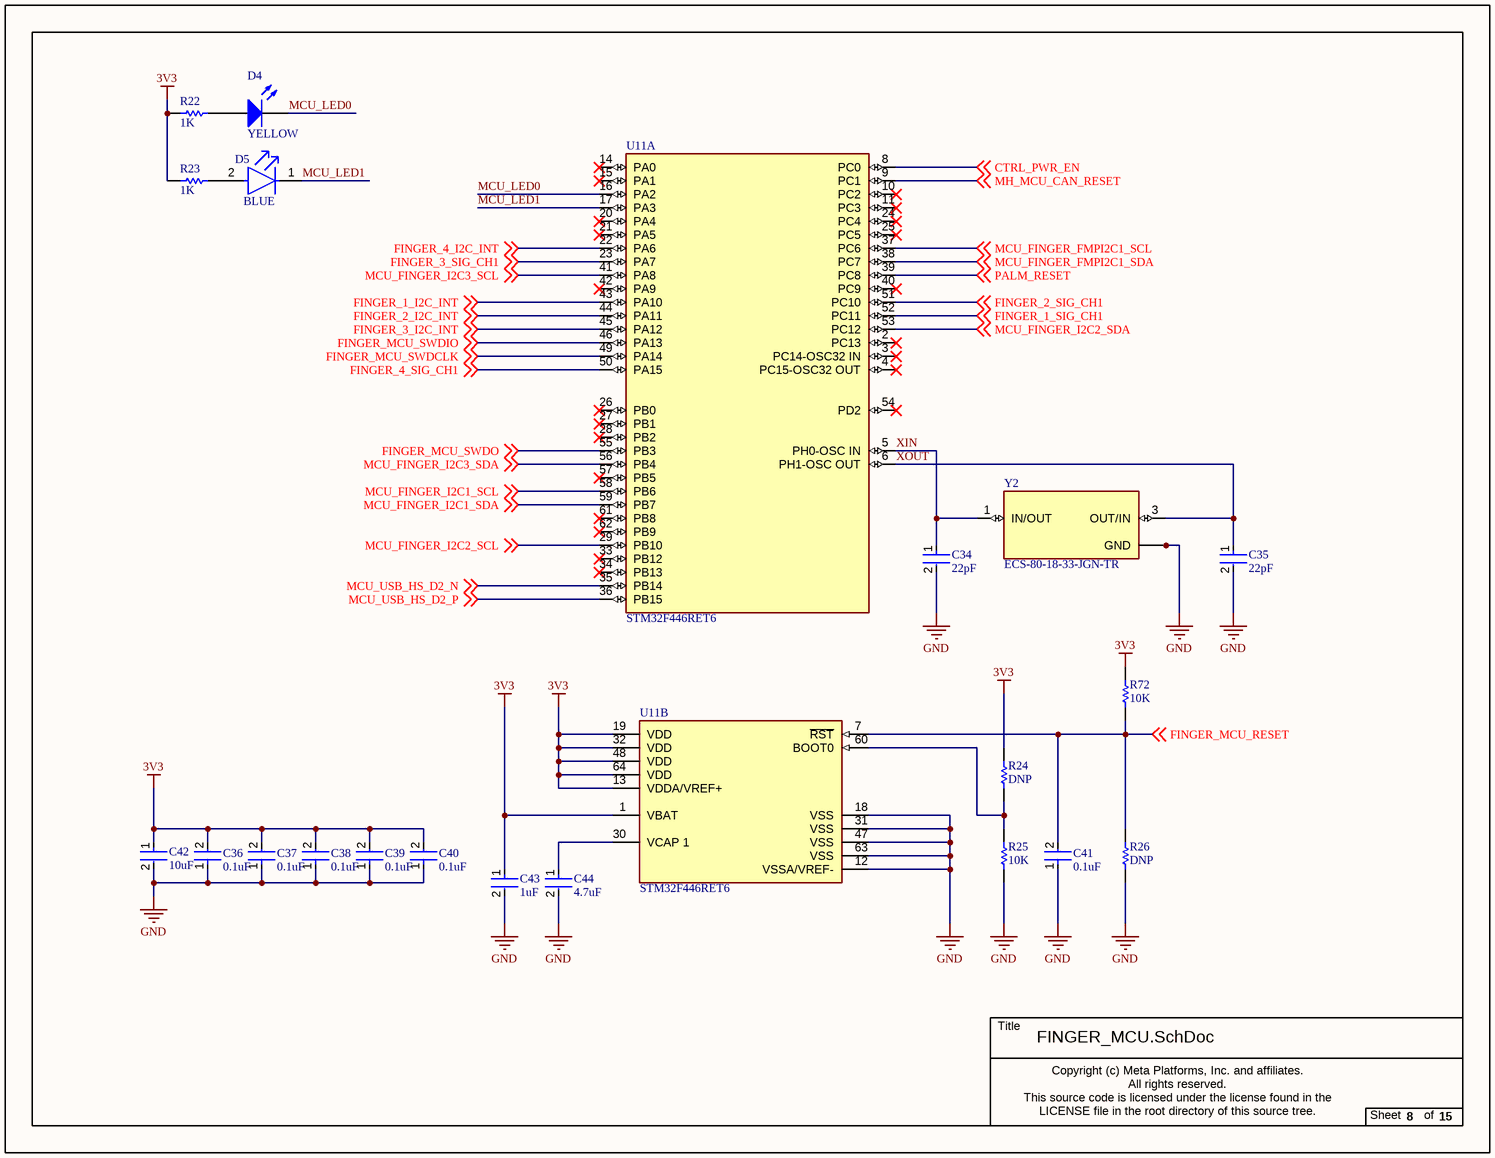
[diagram p7: FINGER_MCU.SchDoc]

### Parts
C34  22pF  [FP-0402-L_1_0_1-W_0_5_0_1-MFG]
C35  22pF  [FP-0402-L_1_0_1-W_0_5_0_1-MFG]
C36  0.1uF  [FP-CC0201-BA-MFG]
C37  0.1uF  [FP-CC0201-BA-MFG]
C38  0.1uF  [FP-CC0201-BA-MFG]
C39  0.1uF  [FP-CC0201-BA-MFG]
C40  0.1uF  [FP-CC0201-BA-MFG]
C41  0.1uF  [FP-CC0201-BA-MFG]
C42  10uF  [FP-CL05A106MP5NUNC-MFG]
C43  1uF  [FP-CL511-IPC_C]
C44  4.7uF  [FP-C1005-050-0_15-MFG]
D4  YELLOW  [0603_A]
D5  BLUE  [FP-LTST-C191TBKT-MFG]
R22  1K  [RESC1005X40X25NL05T05]
R23  1K  [RESC1005X40X25NL05T05]
R24  DNP  [RESC1005X40X25ML05T10]
R25  10K  [RESC1005X40X25ML05T10]
R26  DNP  [RESC1005X40X25NL05T10]
R72  10K  [RESC1005X40X25ML05T10]
U11  STM32F446RET6  [FP-LQFP64-5W-MFG]  (parts A,B of 2)
Y2  ECS-80-18-33-JGN-TR  [XTAL_ECS-240-8-33-AGN-TR]

### Nets
3V3: C36.2 C37.2 C38.2 C39.2 C40.2 C42.1 C43.1 R22.1 R23.1 R24.2 R72.2 U11.1(VBAT) U11.13(VDDA/VREF+) U11.19(VDD) U11.32(VDD) U11.48(VDD) U11.64(VDD)
GND: C34.2 C35.2 C36.1 C37.1 C38.1 C39.1 C40.1 C41.1 C42.2 C43.2 C44.2 R25.1 R26.1 U11.12(VSSA/VREF-) U11.18(VSS) U11.31(VSS) U11.47(VSS) U11.63(VSS) Y2.2(GND) Y2.4(GND)
CTRL_PWR_EN: U11.8(PC0) ; off-sheet CTRL_PWR_EN
FINGER_1_I2C_INT: U11.43(PA10) ; off-sheet FINGER_1_I2C_INT
FINGER_1_SIG_CH1: U11.52(PC11) ; off-sheet FINGER_1_SIG_CH1
FINGER_2_I2C_INT: U11.44(PA11) ; off-sheet FINGER_2_I2C_INT
FINGER_2_SIG_CH1: U11.51(PC10) ; off-sheet FINGER_2_SIG_CH1
FINGER_3_I2C_INT: U11.45(PA12) ; off-sheet FINGER_3_I2C_INT
FINGER_3_SIG_CH1: U11.23(PA7) ; off-sheet FINGER_3_SIG_CH1
FINGER_4_I2C_INT: U11.22(PA6) ; off-sheet FINGER_4_I2C_INT
FINGER_4_SIG_CH1: U11.50(PA15) ; off-sheet FINGER_4_SIG_CH1
FINGER_MCU_RESET: C41.2 R26.2 R72.1 U11.7(~{RST}) ; off-sheet FINGER_MCU_RESET
FINGER_MCU_SWDCLK: U11.49(PA14) ; off-sheet FINGER_MCU_SWDCLK
FINGER_MCU_SWDIO: U11.46(PA13) ; off-sheet FINGER_MCU_SWDIO
FINGER_MCU_SWDO: U11.55(PB3) ; off-sheet FINGER_MCU_SWDO
MCU_FINGER_FMPI2C1_SCL: U11.37(PC6) ; off-sheet MCU_FINGER_FMPI2C1_SCL
MCU_FINGER_FMPI2C1_SDA: U11.38(PC7) ; off-sheet MCU_FINGER_FMPI2C1_SDA
MCU_FINGER_I2C1_SCL: U11.58(PB6) ; off-sheet MCU_FINGER_I2C1_SCL
MCU_FINGER_I2C1_SDA: U11.59(PB7) ; off-sheet MCU_FINGER_I2C1_SDA
MCU_FINGER_I2C2_SCL: U11.29(PB10) ; off-sheet MCU_FINGER_I2C2_SCL
MCU_FINGER_I2C2_SDA: U11.53(PC12) ; off-sheet MCU_FINGER_I2C2_SDA
MCU_FINGER_I2C3_SCL: U11.41(PA8) ; off-sheet MCU_FINGER_I2C3_SCL
MCU_FINGER_I2C3_SDA: U11.56(PB4) ; off-sheet MCU_FINGER_I2C3_SDA
MCU_LED0: D4.1(K) U11.16(PA2)
MCU_LED1: D5.1(C) U11.17(PA3)
MCU_USB_HS_D2_N: U11.35(PB14) ; off-sheet MCU_USB_HS_D2_N
MCU_USB_HS_D2_P: U11.36(PB15) ; off-sheet MCU_USB_HS_D2_P
MH_MCU_CAN_RESET: U11.9(PC1) ; off-sheet MH_MCU_CAN_RESET
PALM_RESET: U11.39(PC8) ; off-sheet PALM_RESET
XIN: C34.1 U11.5(PH0-OSC_IN) Y2.1(IN/OUT)
XOUT: C35.1 U11.6(PH1-OSC_OUT) Y2.3(OUT/IN)
NetC44_1: C44.1 U11.30(VCAP_1)
NetD4_2: D4.2(A) R22.2
NetD5_2: D5.2(A) R23.2
NetR24_1: R24.1 R25.2 U11.60(BOOT0)

Not connected (* = marked no-connect by the designer): U11 2(PC13)* 3(PC14-OSC32_IN)* 4(PC15-OSC32_OUT)* 10(PC2)* 11(PC3)* 14(PA0)* 15(PA1)* 20(PA4)* 21(PA5)* 24(PC4)* 25(PC5)* 26(PB0)* 27(PB1)* 28(PB2)* 33(PB12)* 34(PB13)* 40(PC9)* 42(PA9)* 54(PD2)* 57(PB5)* 61(PB8)* 62(PB9)*

### Notes on the sheet
- Title
- Copyright (c) Meta Platforms, Inc. and affiliates.
  All rights reserved.
  This source code is licensed under the license found in the
  LICENSE file in the root directory of this source tree.
- Sheet
- of

### Library data of the parts
C34 C35 = CMP-2008-02613-2: as C28 on sheet HAND_CAN_MCU; Temperature Coefficient: 30ppm/°C; Mount: Surface Mount; Length: 1mm; Construction: Flat; Contact Plating: Tin; REACH SVHC: No SVHC; Case/Package: 0402; Voltage: 50V; Case Code (Imperial): 0402; Thickness: 0.022inch; Radiation Hardening: No; Number of Pins: 2; Tolerance: 5%; Max Operating Temperature: 125°C; RoHS Compliant: Yes; Voltage Rating: 50V; Case Code (Metric): 1005; Package Quantity: 1; Width: 0.02inch; Termination: SMD/SMT; Lead Free: Lead Free; Height: 0.5mm; Voltage Rating (DC): 50V; Capacitance: 22pF; Min Operating Temperature: -55°C; Series: -; Depth: 0.5mm; Dielectric: C0G; Packaging: Tape and Reel
C36-C41 = CMP-03422-000376-1: as C111 on sheet ALLEGRO_CONNECTOR; Automotive: No; Device Class L2: Capacitors; Temperature Range High: +85°C; Capacitance: 100 nF; Temperature: -55°C to +85°C; ComponentLink2URL: http://www.yageo.com/documents/recent/UPY-GPHC_X5R_4V-to-50V_25.pdf; Category: Cap; Mouser Description: Multilayer Ceramic Capacitors MLCC - SMD/SMT 100nF 6.3V X5R 10%; Ipc Land Pattern Name: CAPC6030X30; Temperature Characteristic: X5R; Voltage Rating: 6.3 V; Lead Free: Yes; Digikey Description: CAP CER 0.1UF 6.3V X5R 0201; Device Class L1: Passive Components; Octopart: https://octopart.com/cc0201krx5r5bb104-yageo-9292636; Height: 0.33mm; Package: CC0201-BA; Footprint Url: http://www.yageo.com/exep/pages/download/literatures/UPY-C_GEN_24.pdf; ComponentLink2Description: Datasheet; Device Class L3: Ceramic Capacitors; Temperature Range Low: -55°C; RoHS: TRUE
C42 = CMP-13271-000002-1: as C27 on sheet HAND_CAN_MCU; Octopart: https://octopart.com/cl05a106mp5nunc-samsung-22457395; Voltage Rating: 10V; RoHS: TRUE; Value: 10uF; Height: 0.7mm; Digikey Description: CAP CER 10UF 10V X5R 0402; Automotive: No; Package: CL05A106MP5NUNC; Device Class L1: Passive Components; Capacitance: 10uF; Temperature Range High: +85°C; ComponentLink2Description: Datasheet; Device Class L2: Capacitors; Temperature Characteristic: X5R; Temperature: -55°C to +85°C; ComponentLink2URL: http://www.samsungsem.com/kr/support/product-search/mlcc/__icsFiles/afieldfile/2019/05/10/19-CL05A106MP5NUNC.pdf; Device Class L3: Ceramic Capacitors; Category: Cap; Temperature Range Low: -55°C; Ipc Land Pattern Name: CAPC10050X50; Lead Free: Yes
C43 = CMP-13271-001936-1: Cap Ceramic 1uF 10V X5R ±10% SMD 0402 +85°C Paper T/R; Depth: 0.5mm; Case Code (Imperial): 0402; Material: Ceramic; Mount: Surface Mount; Thickness: 0.022inch; Dielectric: X5R; Capacitance: 1uF; Radiation Hardening: No; Case/Package: 0402; Length: 1mm; Tolerance: 10%; Max Operating Temperature: 85°C; Package Quantity: 1; Width: 0.02inch; Voltage Rating: 10V; Contact Plating: Tin; Height: 0.5mm; Min Operating Temperature: -55°C; Case Code (Metric): 1005; Packaging: Tape and Reel
C44 = CMP-2000-05997-2: CAP CER 4.7UF 10V X5R 0402; Dielectric Material: Ceramic; Tolerance: 10%; Series: C; Package Quantity: 10000; Max Operating Temperature: 85°C; Case Code (Imperial): 0402; Lead Free: Lead Free; Voltage Rating (DC): 10V; Packaging: Cut Tape; Voltage Rating: 10V; Min Operating Temperature: -55°C; Dielectric: X5R; Thickness: 0.022inch; Width: 0.02inch; Case/Package: 0402; Case Code (Metric): 1005; Capacitance: 4.7uF; Length: 0.039inch; RoHS Compliant: Yes; REACH SVHC: No SVHC; Mount: Surface Mount
D4 = CMP-1426-00005-1: as D2 on sheet HAND_CAN_MCU; ComponentLink1URL: http://www.we-online.com; Color: Yellow; ComponentLink2Description: Datasheet; ComponentLink2URL: http://katalog.we-online.com/led/datasheet/150060YS75000.pdf; ComponentLink1Description: Manufacturer URL; PackageReference: 0603_A
D5 = CMP-22017-000008-1: as D3 on sheet HAND_CAN_MCU; Case Code (Metric): 1608; Packaging: Tape and Reel; Case/Package: 0603; Depth: 1.6mm; Mount: Surface Mount; Lead Free: Lead Free; Min Operating Temperature: -20°C; Lens Transparency: Clear; Illumination Color: Blue; Height: 0.55mm; Test Current: 20mA; Case Code (Imperial): 0603; Max Operating Temperature: 80°C; Number of Pins: 2; Length: 0.8mm; Radiation Hardening: No; Package Quantity: 1; Number of LEDs: 1; Width: 0.8mm; Color: Blue
R22 R23 = CMP-1011-00510-4: as R14 on sheet HAND_CAN_MCU; DatasheetVersion: 04/2015; Radiation Hardening: No; Pins: 2; Height: 0.35 mm; RoHSCompliant: true; Case Code (Imperial): 0402; ComponentLink2Description: Datasheet; ComponentLink1Description: Manufacturer URL; PackageReference: 0402; Mount: Surface Mount; Package Quantity: 10000; Tolerance: 1%; ComponentLink1URL: http://www.panasonic.com/; PackageDescription: 2-Pin Surface Mount Device, Body 1 x 0.5 mm; Mounting Technology: Surface Mount; Case Code (Metric): 1005; ComponentLink2URL: http://industrial.panasonic.com/cdbs/www-data/pdf/RDA0000/AOA0000C86.pdf; REACH SVHC: Yes; Packaging: Tape and Reel; Max Operating Temperature: 155 degC; Min Operating Temperature: -55 degC; Width: 0.5 mm; Length: 1 mm
R24 R25 R72 = CMP-2002-03043-1: as R16 on sheet HAND_CAN_MCU
R26 = CMP-1011-00001-2: as R17 on sheet HAND_CAN_MCU
U11 = CMP-12105-000007-1: IC MCU 32BIT 512KB FLASH 64LQFP; Manufacturer: ST; Number Of Spi Channels: 4; Ram Size: 128KBytes; Standoff Height: 0.05mm; Number Of Uart Channels: 6; Number Of Pwm Channels: 32; Max Junction Temp: +105°C; Number Of I/Os: 50; Number Of Usb Channels: 2; Frequency: 180MHz; Number Of A/D Converters: 3; Max Supply Voltage: 3.6V; Number Of Adc Channels: 16; Interface: I2C,SPI,UART,USART,CAN,USB,LIN,IrDA,I2S,Other; Memory Size: 512KBytes; Number Of Timers/Counters: 14; Min Supply Voltage: 1.7V; Core Architecture: ARM Cortex-M4; Data Bus Width: 32bits; Number Of Cores: 1; Ambient Temperature Range Low: -40°C; ComponentLink2URL: https://www.st.com/en/microcontrollers-microprocessors/stm32f446re.html; Category: IC; Height: 1.6mm; Ipc Land Pattern Name: QFP50P1200X1200X160-64; Manufacturer Part Number: STM32F446RET6; Octopart: https://octopart.com/stm32f446ret6-stmicroelectronics-52642920; Temperature Range High: +105°C; Lead Free: Yes; Mouser Description: ARM Microcontrollers - MCU High-performance and DSP with FP, ARM Cortex-M4 MCU with 512 Kbytes Flash, 180 MHz CPU, Art Accelerator, SDRAM; Digikey Description: IC MCU 32BIT 512KB FLASH 64LQFP; Ambient Temperature Range High: +85°C; Number Of I2C Channels: 4; Memory Type: FLASH; RoHS: TRUE; Automotive: No; Device Class L1: Integrated Circuits (ICs); Temperature: -40°C to +105°C; Device Class L2: Embedded Processors and Controllers; Device Class L3: Microcontrollers; Temperature Range Low: -40°C; Package: LQFP64-5W; ComponentLink2Description: Datasheet
Y2 = ECS-80-18-33-JGN-TR: as Y1 on sheet HAND_CAN_MCU; Price: None; Value: *; Package: None; Availability: Unavailable; MP: ECS-80-18-33-JGN-TR

## Sheet USB_CONNECTOR.SchDoc
size Letter; SheetNumber: 9; SheetTotal: 15
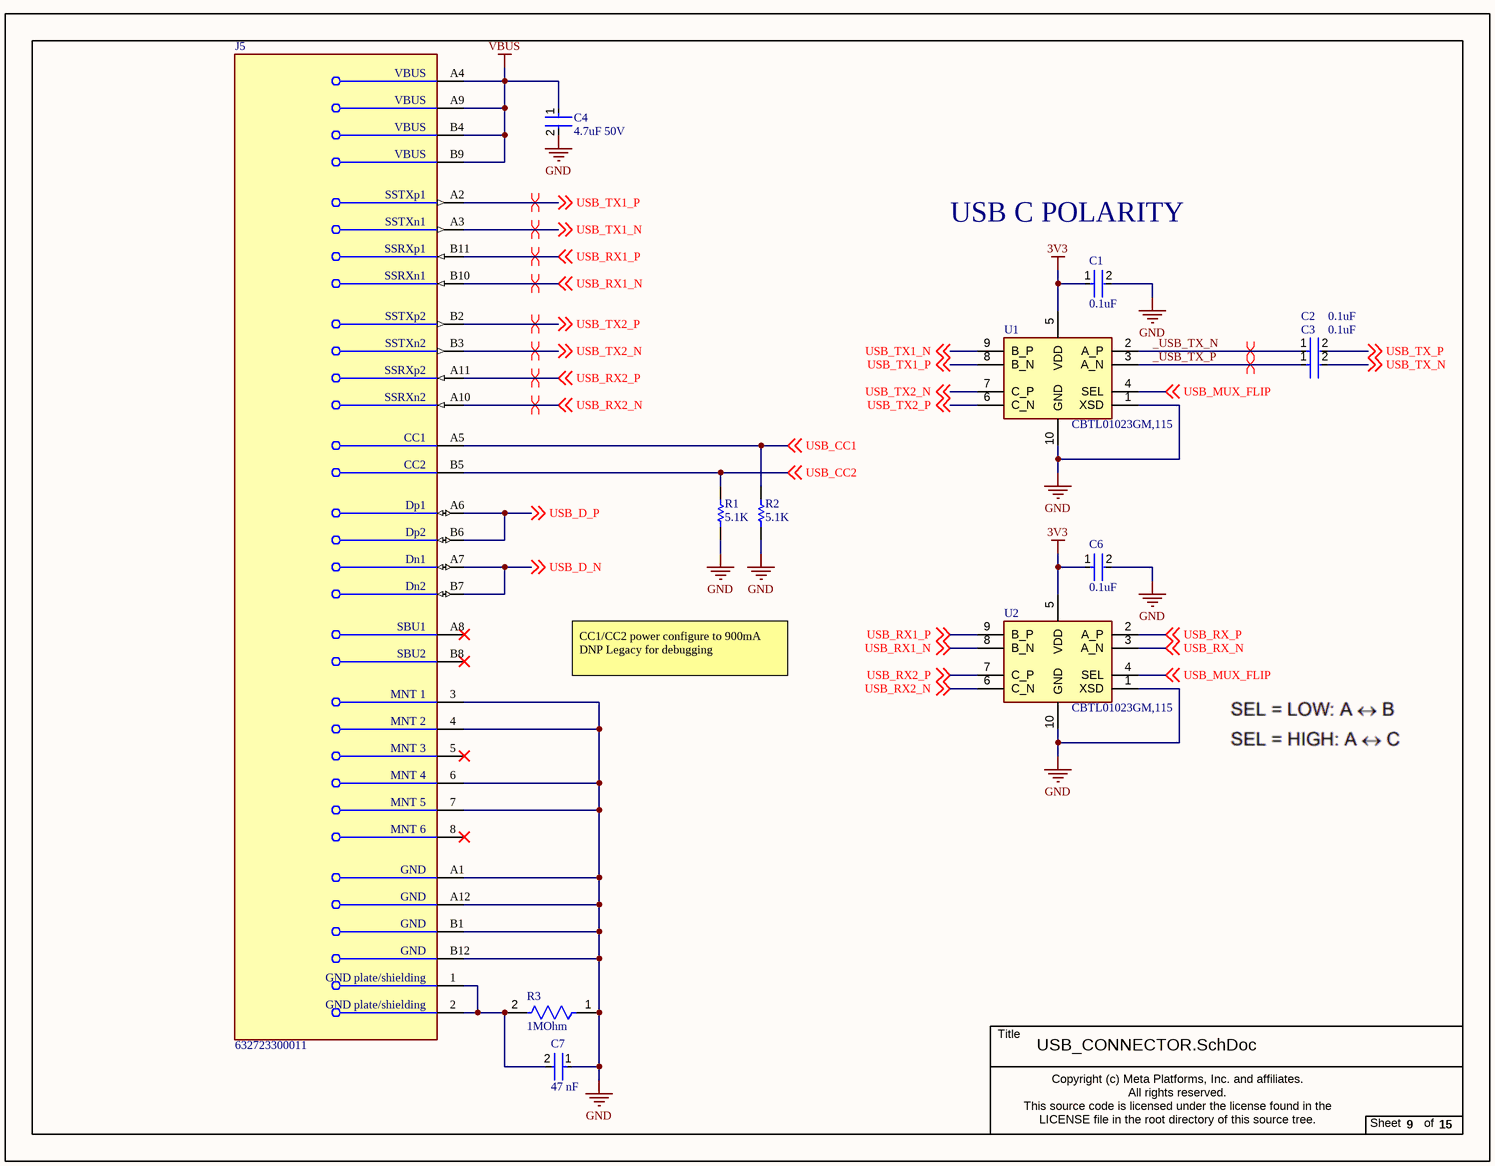
[diagram p8: USB_CONNECTOR.SchDoc]

### Parts
C1  0.1uF  [FP-CC0201-BA-MFG]
C2  0.1uF  [FP-CC0201-BA-MFG]
C3  0.1uF  [FP-CC0201-BA-MFG]
C4  4.7uF 50V  [FP-C2012-125-0_2-IPC_B]
C6  0.1uF  [FP-CC0201-BA-MFG]
C7  47 nF  [FP-CC0402-MFG]
J5  632723300011  [FP-632723300011-MFG]
R1  5.1K  [RESC1005X40X25NL05T10]
R2  5.1K  [RESC1005X40X25NL05T10]
R3  1MOhm  [FP-RMCF0402-MFG]
U1  CBTL01023GM,115  [QFN50P200X155X50-10N]
U2  CBTL01023GM,115  [QFN50P200X155X50-10N]

### Nets
3V3: C1.1 C6.1 U1.5(VDD) U2.5(VDD)
GND: C1.2 C4.2 C6.2 C7.1 J5.3(MNT_1) J5.4(MNT_2) J5.6(MNT_4) J5.7(MNT_5) J5.A1(GND) J5.A12(GND) J5.B1(GND) J5.B12(GND) R1.1 R2.1 R3.1 U1.1(XSD) U1.10(GND) U2.1(XSD) U2.10(GND)
VBUS: C4.1 J5.A4(VBUS) J5.A9(VBUS) J5.B4(VBUS) J5.B9(VBUS)
_USB_TX_N: C2.1 U1.2(A_P)
_USB_TX_P: C3.1 U1.3(A_N)
USB_CC1: J5.A5(CC1) R2.2 ; off-sheet USB_CC1
USB_CC2: J5.B5(CC2) R1.2 ; off-sheet USB_CC2
USB_D_N: J5.A7(Dn1) J5.B7(Dn2) ; off-sheet USB_D_N
USB_D_P: J5.A6(Dp1) J5.B6(Dp2) ; off-sheet USB_D_P
USB_MUX_FLIP: U1.4(SEL) U2.4(SEL) ; off-sheet USB_MUX_FLIP
USB_RX1_N: J5.B10(SSRXn1) U2.8(B_N) ; off-sheet USB_RX1_N
USB_RX1_P: J5.B11(SSRXp1) U2.9(B_P) ; off-sheet USB_RX1_P
USB_RX2_N: J5.A10(SSRXn2) U2.6(C_N) ; off-sheet USB_RX2_N
USB_RX2_P: J5.A11(SSRXp2) U2.7(C_P) ; off-sheet USB_RX2_P
USB_RX_N: U2.3(A_N) ; off-sheet USB_RX_N
USB_RX_P: U2.2(A_P) ; off-sheet USB_RX_P
USB_TX1_N: J5.A3(SSTXn1) U1.9(B_P) ; off-sheet USB_TX1_N
USB_TX1_P: J5.A2(SSTXp1) U1.8(B_N) ; off-sheet USB_TX1_P
USB_TX2_N: J5.B3(SSTXn2) U1.7(C_P) ; off-sheet USB_TX2_N
USB_TX2_P: J5.B2(SSTXp2) U1.6(C_N) ; off-sheet USB_TX2_P
USB_TX_N: C3.2 ; off-sheet USB_TX_N
USB_TX_P: C2.2 ; off-sheet USB_TX_P
NetC7_2: C7.2 J5.1(GND_plate/shielding) J5.2(GND_plate/shielding) R3.2

Not connected (* = marked no-connect by the designer): J5 5(MNT_3)* 8(MNT_6)* A8(SBU1)* B8(SBU2)*

### Layout directives
differential pair: _USB_TX_N, _USB_TX_P, USB_RX1_N, USB_RX1_P, USB_RX2_N, USB_RX2_P, USB_TX1_N, USB_TX1_P, USB_TX2_N, USB_TX2_P

### Notes on the sheet
- USB C POLARITY
- CC1/CC2 power configure to 900mA
  DNP Legacy for debugging
- Title
- Copyright (c) Meta Platforms, Inc. and affiliates.
  All rights reserved.
  This source code is licensed under the license found in the
  LICENSE file in the root directory of this source tree.
- Sheet
- of

### Library data of the parts
C1-C3 C6 = CMP-03422-000376-1: as C111 on sheet ALLEGRO_CONNECTOR; Automotive: No; Device Class L2: Capacitors; Temperature Range High: +85°C; Capacitance: 100 nF; Temperature: -55°C to +85°C; ComponentLink2URL: http://www.yageo.com/documents/recent/UPY-GPHC_X5R_4V-to-50V_25.pdf; Category: Cap; Mouser Description: Multilayer Ceramic Capacitors MLCC - SMD/SMT 100nF 6.3V X5R 10%; Ipc Land Pattern Name: CAPC6030X30; Temperature Characteristic: X5R; Voltage Rating: 6.3 V; Lead Free: Yes; Digikey Description: CAP CER 0.1UF 6.3V X5R 0201; Device Class L1: Passive Components; Octopart: https://octopart.com/cc0201krx5r5bb104-yageo-9292636; Height: 0.33mm; Package: CC0201-BA; Footprint Url: http://www.yageo.com/exep/pages/download/literatures/UPY-C_GEN_24.pdf; ComponentLink2Description: Datasheet; Device Class L3: Ceramic Capacitors; Temperature Range Low: -55°C; RoHS: TRUE
C4 = CMP-08246-000007-2: Multilayer Ceramic Capacitors 4.7μF ±10% 50V X5R SMD 0805; Case Code (Metric): 2012; Weight: 0.000194oz; Voltage Rating: 50V; Voltage: 50V; Construction: Flat; Series: C; Packaging: Tape and Reel; Height: 1.25mm; Depth: 1.25mm; Resistor Type: Ceramic; Width: 0.049inch; Length: 2mm; Thickness: 0.057inch; REACH SVHC: No SVHC; Max Operating Temperature: 85°C; Case/Package: 0805; Capacitance: 4.7uF; Dielectric: X5R; Tolerance: 10%; Dielectric Material: Ceramic; Package Quantity: 1; Mount: Surface Mount; Radiation Hardening: No; Voltage Rating (DC): 50V; Case Code (Imperial): 0805; Termination: SMD/SMT; Min Operating Temperature: -55°C; Lead Free: Lead Free
C7 = CMP-03422-000813-1: as C112 on sheet WALL_POWER; Temperature: -55°C to +125°C; Category: Cap; Voltage Rating: 25 V; Digikey Description: CAP CER 0.047UF 25V X7R 0402; Device Class L1: Passive Components; Device Class L3: Ceramic Capacitors; Ipc Land Pattern Name: CAPC10050X50; Value: 47 nF; Temperature Characteristic: X7R; Temperature Range High: +125°C; ComponentLink2URL: http://www.yageo.com/documents/recent/UPY-GP_NP0_16V-to-50V_16.pdf; Automotive: No; Temperature Range Low: -55°C; Package: CC0402; RoHS: TRUE; Height: 0.55mm; Device Class L2: Capacitors; Capacitance: 47 nF; Octopart: https://octopart.com/cc0402krx7r8bb473-yageo-22850998; Lead Free: Yes; Mouser Description: Multilayer Ceramic Capacitors MLCC - SMD/SMT 47nF 25V X7R 10%; Footprint Url: http://www.yageo.com/exep/pages/download/literatures/UPY-C_GEN_24.pdf; ComponentLink2Description: Datasheet
J5 = CMP-1502-03214-2: CONN RCP USB3.1 TYPEC 24P SMD RA; Number of Ports: 1; Connector Type: USB; Mating Cycles: 10000; Number of Contacts: 24; Gender: Receptacle; Shielding: Unshielded; RoHS Compliant: Yes; Mount: Surface Mount; Termination: Solder; Min Operating Temperature: -40°C; Packaging: Cut Tape; Contact Plating: Gold; Max Operating Temperature: 105°C; Flammability Rating: UL94 V-0; Insulation Color: Black; Series: -
R1 R2 = CMP-2002-07753-1: Part Number: RC0402FR-075K1L; Manufacturer: Yageo / Phycomp
R3 = CMP-2000-06985-2: as R60 on sheet WALL_POWER; Resistor Type: Thick Film; Military Standard: Not; Packaging: Tape and Reel; Radiation Hardening: No; Construction: Rectangular; Length: 1mm; Case/Package: 0402; Width: 0.02inch; Case Code (Imperial): 0402; Lead Free: Lead Free; Number of Terminations: 2; Min Operating Temperature: -55°C; Height: 0.016inch; Tolerance: 1%; Contact Plating: Tin; Case Code (Metric): 1005; Depth: 0.5mm; Features: Automotive AEC-Q200; Max Operating Temperature: 155°C; Size Code: 0402; Mount: Surface Mount; RoHS Compliant: Yes; Series: RMCF
U1 U2 = CBTL01023GM,115: DisplayPort, PCIe, USB Switch IC 1 Channel 10-XQFN (1.55x2); Manufacturer: NXP USA Inc.; Part Number: CBTL01023GM,115